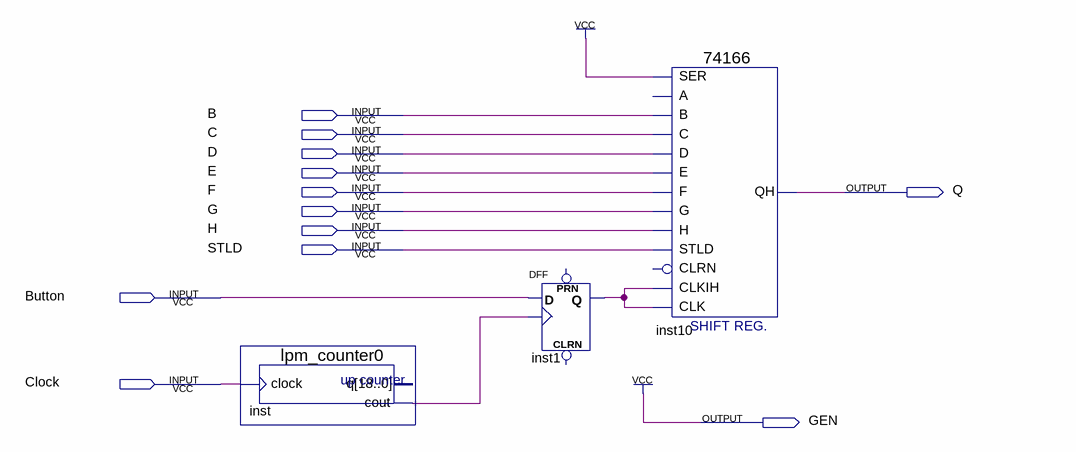
[diagram p0: schematic sheet]
// Quartus schematic lab5_3.bdf as structural Verilog: 3 symbols, 12 pins
module lab5_3 (
  input  B,
  input  C,
  input  D,
  input  E,
  input  F,
  input  G,
  input  H,
  input  STLD,
  input  Button,
  input  Clock,
  output Q,
  output GEN
);

  wire inst1_q, inst_cout;

  lpm_counter0 inst (.clock(Clock), .cout(inst_cout));  // open: q
  DFF inst1 (.CLK(inst_cout), .D(Button), .Q(inst1_q));  // open: CLRN, PRN
  \74166  inst10 (
    .SER(1'b1), .C(C), .D(D), .E(E), .B(B), .STLD(STLD), .H(H), .G(G), .F(F), .CLK(inst1_q), .CLKIH(inst1_q),
    .QH(Q));  // open: A, CLRN

  assign GEN = 1'b1;
endmodule
